# EAGLE design LockSequencer (EAGLE 7.7.0)
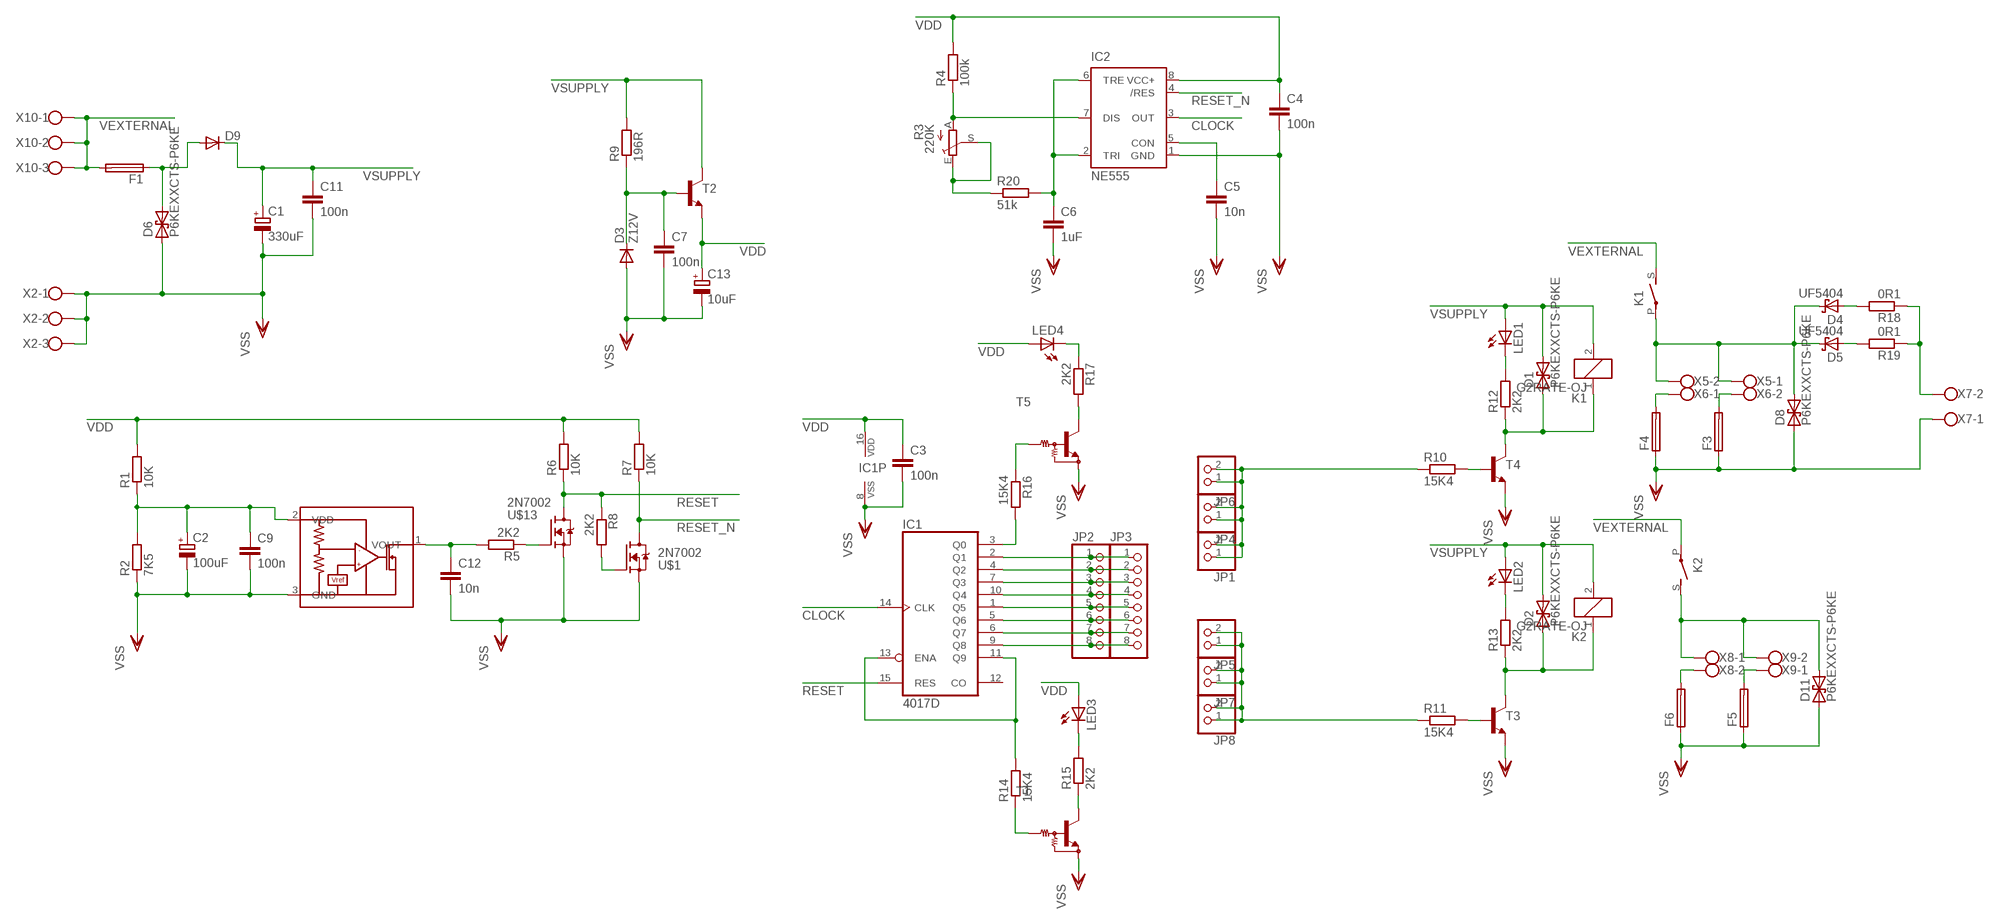
[diagram p0: schematic, sheet 1]

## Parts
C1  330uF  CPOL-EUE3.5-8  [E3,5-8]
C2  100uF  CPOL-EUE2-5  [E2-5]
C3  100n  C-EUC1206K  [C1206K]
C4  100n  C-EU050-024X044  [C050-024X044]
C5  10n  C-EUC1206K  [C1206K]
C6  1uF  C-EUC1206K  [C1206K]
C7  100n  C-EUC1206K  [C1206K]
C9  100n  C-EUC1206K  [C1206K]
C11  100n  C-EU050-024X044  [C050-024X044]
C12  10n  C-EUC1206K  [C1206K]
C13  10uF  CPOL-EUE2-5  [E2-5]
D1  P6KEXXCTS-P6KE  [DO15-10]
D2  P6KEXXCTS-P6KE  [DO15-10]
D3  Z12V  DIODE-SOD323-W  [SOD323-W]
D4  UF5404  SCHOTTKY-DIODECB429-15VR  [CB429-15R]
D5  UF5404  SCHOTTKY-DIODECB429-15V  [CB429-15V]
D6  P6KEXXCTS-P6KE  [DO15-10]
D8  P6KEXXCTS-P6KE  [DO15-10]
D9  DIODE-SOD123  [SOD123]
D11  P6KEXXCTS-P6KE  [DO15-10]
F1  TE5  [TE5]
F3  TE5  [TE5]
F4  TE5  [TE5]
F5  TE5  [TE5]
F6  TE5  [TE5]
IC1  4017D  [SO16]
IC2  NE555  [DIL-08]
JP1  PINHD-1X2  [1X02]
JP2  PINHD-1X8  [1X08]
JP3  PINHD-1X8  [1X08]
JP4  PINHD-1X2  [1X02]
JP5  PINHD-1X2  [1X02]
JP6  PINHD-1X2  [1X02]
JP7  PINHD-1X2  [1X02]
JP8  PINHD-1X2  [1X02]
K1  G2RATE-OJ  [G2RA-SHORTER]
K2  G2RATE-OJ  [G2RA-SHORTER]
LED1  LED5MM  [LED5MM]
LED2  LED5MM  [LED5MM]
LED3  LED5MM  [LED5MM]
LED4  LED5MM  [LED5MM]
R1  10K  R-EU_0207/7  [0207/7]
R2  7K5  R-EU_0207/7  [0207/7]
R3  220K  TRIM_EU-CA9V  [CA9V]
R4  100k  R-EU_0207/7  [0207/7]
R5  2K2  R-EU_R0402  [R0402]
R6  10K  R-EU_0207/7  [0207/7]
R7  10K  R-EU_R0805  [R0805]
R8  2K2  R-EU_0207/7  [0207/7]
R9  196R  R-EU_R0805  [R0805]
R10  15K4  R-EU_R0603  [R0603]
R11  15K4  R-EU_R0603  [R0603]
R12  2K2  R-EU_0207/7  [0207/7]
R13  2K2  R-EU_0207/7  [0207/7]
R14  15K4  R-EU_R0603  [R0603]
R15  2K2  R-EU_0207/7  [0207/7]
R16  15K4  R-EU_R0603  [R0603]
R17  2K2  R-EU_0207/7  [0207/7]
R18  0R1  R-EU_R2512  [R2512]
R19  0R1  R-EU_R2512  [R2512]
R20  51k  R-EU_0207/7  [0207/7]
T1  -NPN_DRIVER-  [SOT23]
T2  MMBTA42LT1-NPN-SOT23-BEC  [SOT23-BEC]
T3  MMBTA42LT1-NPN-SOT23-BEC  [SOT23-BEC]
T4  MMBTA42LT1-NPN-SOT23-BEC  [SOT23-BEC]
T5  -NPN_DRIVER-  [SOT23]
U$1  2N7002  [SOT23]
U$4  BU48XXG  [SOT95P280X125-5N]
U$13  2N7002  [SOT23]
X2  W237-103  [W237-103]
X5  W237-102  [W237-102]
X6  W237-102  [W237-102]
X7  W237-102  [W237-102]
X8  W237-102  [W237-102]
X9  W237-102  [W237-102]
X10  W237-103  [W237-103]

## Nets
CLOCK: IC1.14(CLK) IC2.3(OUT)
LATCH: JP1.1 JP1.2 JP4.1 JP4.2 JP6.1 JP6.2 R10.1
N$1: C5.1 IC2.5(CON)
N$2: C2.+ C9.1 R1.1 R2.2 U$4.2(VDD)
N$3: C12.1 R5.2 U$4.1(VOUT)
N$4: IC1.11(Q9) IC1.13(ENA) R14.2
N$5: IC1.5(Q6) JP2.6 JP3.6
N$6: IC1.6(Q7) JP2.7 JP3.7
N$7: IC1.7(Q3) JP2.3 JP3.3
N$8: LED2.K(C) R13.2
N$9: IC1.1(Q5) JP2.5 JP3.5
N$10: LED1.K(C) R12.2
N$11: F3.2 X6.2
N$12: IC1.9(Q8) JP2.8 JP3.8
N$13: LED4.K(C) R17.1
N$14: C6.1 IC2.2(TRI) IC2.6(TRE) R20.2
N$15: R10.2 T4.B
N$16: R14.1 T1.1(B)
N$17: R17.2 T5.3(C)
N$18: D2.A K2.1 R13.1 T3.C
N$20: IC1.3(Q0) R16.2
N$21: D4.C D5.C D8.C K1.P(2:P) X5.1 X5.2
N$22: F5.2 X9.1
N$23: R5.1 U$13.1(G)
N$24: IC2.7(DIS) R3.A R4.1
N$25: C7.1 D3.C R9.1 T2.B
N$26: R11.2 T3.B
N$27: D1.A K1.1 R12.1 T4.C
N$28: R8.2 U$1.1(G)
N$29: D4.A R18.2
N$30: F4.2 X6.1
N$31: R3.E R3.S R20.1
N$32: LED3.K(C) R15.2
N$33: R15.1 T1.3(C)
N$34: IC1.2(Q1) JP2.1 JP3.1
N$35: IC1.4(Q2) JP2.2 JP3.2
N$36: R16.1 T5.1(B)
N$37: D5.A R19.2
N$38: IC1.10(Q4) JP2.4 JP3.4
N$40: R18.1 R19.1 X7.2
N$43: D11.C K2.S(2:S) X8.1 X9.2
N$44: F6.2 X8.2
OPEN: JP5.1 JP5.2 JP7.1 JP7.2 JP8.1 JP8.2 R11.1
RESET: IC1.15(RES) R6.1 R8.1 U$13.3(D)
RESET_N: IC2.4(/RES) R7.1 U$1.3(D)
VDD [Ground]: C3.1 C4.1 C13.+ IC1.16(VDD) IC2.8(VCC+) LED3.A LED4.A R1.2 R4.2 R6.2 R7.2 T2.E
VEXTERNAL [Ground]: F1.2 K1.S(2:S) K2.P(2:P) X10.1 X10.2 X10.3
VEXTERNAL-FUSED: D6.C D9.A F1.1
VSS [Ground]: C1.- C2.- C3.2 C4.2 C5.2 C6.2 C7.2 C9.2 C11.2 C12.2 C13.- D3.A D6.A D8.A D11.A F3.1 F4.1 F5.1 F6.1 IC1.8(VSS) IC2.1(GND) R2.1 T1.2(E) T3.E T4.E T5.2(E) U$1.2(S) U$4.3(GND) U$13.2(S) X2.1 X2.2 X2.3 X7.1
VSUPPLY [Power]: C1.+ C11.1 D1.C D2.C D9.C K1.2 K2.2 LED1.A LED2.A R9.2 T2.C
Unconnected: IC1.12(CO)

## Library data of the parts
C1 C2 C13 = rcl:CPOL-EU: POLARIZED CAPACITOR, European symbol
C3-C7 C9 C11 C12 = rcl:C-EU: CAPACITOR, European symbol
D1 D2 D6 D8 D11 = diode:P6KEXXC: DIODE transient-voltage suppressor
D3 D9 = diode:DIODE-: DIODE
D4 D5 = diode:SCHOTTKY-DIODE: Schottky Diode
F1 F3-F6 = fuse:TE5: FUSE Wickmann; OC_FARNELL: unknown; OC_NEWARK: unknown
IC1 = 40xx:4017: COUNTER/DIVIDER
IC2 = st-microelectronics:NE555: General purpose bipolar Timer; MF: Arrow Electronics; MPN: NE555N; OC_FARNELL: 1467742; OC_NEWARK: 89K1486
JP1 JP4-JP8 = pinhead:PINHD-1X2: PIN HEADER
JP2 JP3 = pinhead:PINHD-1X8: PIN HEADER
K1 K2 = relay:G2RA: RELAY 1 x norm. open, Omron
LED1-LED4 = led:LED: LED OSRAM: - CHIPLED LG R971, LG N971, LY N971, LG Q971, LY Q971, LO R971, LY R971 LH N974, LH R974 LS Q976, LO Q976, LY Q976 LO Q996 - Hyper CHIPLED LW Q18S LB Q993, LB Q99A, LB R99A - SideLED LS A670, LO A670, LY A670, LG A670, LP A670 LB A673, LV A673, LT A673, LW A673 LH A674 LY A675 LS A676, LA A676, LO A676, LY A676, LW A676 LS A679, LY A679, LG A679 - Hyper Micro SIDELED® LS Y876, LA Y876, LO Y876, LY Y876 LT Y87S - SmartLED LW L88C, LW L88S LB L89C, LB L89S, LG L890 LS L89K, LO L89K, LY L89K LS L896, LA L896, LO L896, LY L896 - TOPLED LS T670, LO T670, LY T670, LG T670, LP T670 LSG T670, LSP T670, LSY T670, LOP T670, LYG T670 LG T671, LOG T671, LSG T671 LB T673, LV T673, LT T673, LW T673 LH T674 LS T676, LA T676, LO T676, LY T676, LB T676, LH T676, LSB T676, LW T676 LB T67C, LV T67C, LT T67C, LS T67K, LO T67K, LY T67K, LW E67C LS E67B, LA E67B, LO E67B, LY E67B, LB E67C, LV E67C, LT E67C LW T67C LS T679, LY T679, LG T679 LS T770, LO T770, LY T770, LG T770, LP T770 LB T773, LV T773, LT T773, LW T773 LH T774 LS E675, LA E675, LY E675, LS T675 LS T776, LA T776, LO T776, LY T776, LB T776 LHGB T686 LT T68C, LB T68C - Hyper Mini TOPLED® LB M676 - Mini TOPLED Santana® LG M470 LS M47K, LO M47K, LY M47K Source: http://www.osram.convergy.de LUXEON: - LUMILED® LXK2-PW12-R00, LXK2-PW12-S00, LXK2-PW14-U00, LXK2-PW14-V00 LXK2-PM12-R00, LXK2-PM12-S00, LXK2-PM14-U00 LXK2-PE12-Q00, LXK2-PE12-R00, LXK2-PE12-S00, LXK2-PE14-T00, LXK2-PE14-U00 LXK2-PB12-K00, LXK2-PB12-L00, LXK2-PB12-M00, LXK2-PB14-N00, LXK2-PB14-P00, LXK2-PB14-Q00 LXK2-PR12-L00, LXK2-PR12-M00, LXK2-PR14-Q00, LXK2-PR14-R00 LXK2-PD12-Q00, LXK2-PD12-R00, LXK2-PD12-S00 LXK2-PH12-R00, LXK2-PH12-S00 LXK2-PL12-P00, LXK2-PL12-Q00, LXK2-PL12-R00 Source: www.luxeon.com KINGBRIGHT: KA-3528ASYC Source: www.kingbright.com
R1 R2 R4-R20 = rcl:R-EU_: RESISTOR, European symbol
R3 = pot:TRIM_EU-: POTENTIOMETER
T1 T5 = transistor:*-NPN_DRIVER-: NPN Bias Resistor Transistor
T2-T4 = transistor:*-NPN-: NPN Transistror BF959 corrected 2008.03.06
U$1 U$13 = transistor-fet:2N7002
U$4 = ROHM_By_element14_Batch_1:BU48XXG
X2 X10 = con-wago-500:W237-103: WAGO SCREW CLAMP; MPN: 237-103; OC_FARNELL: unknown; OC_NEWARK: 18M7116
X5-X9 = con-wago-500:W237-102: WAGO SCREW CLAMP; MPN: 237-102; OC_FARNELL: unknown; OC_NEWARK: 70K9898

## Net classes
1 Power: width 0.318 mm, clearance 0.381 mm
3 Ground: width 0.318 mm, clearance 0.381 mm

## Board
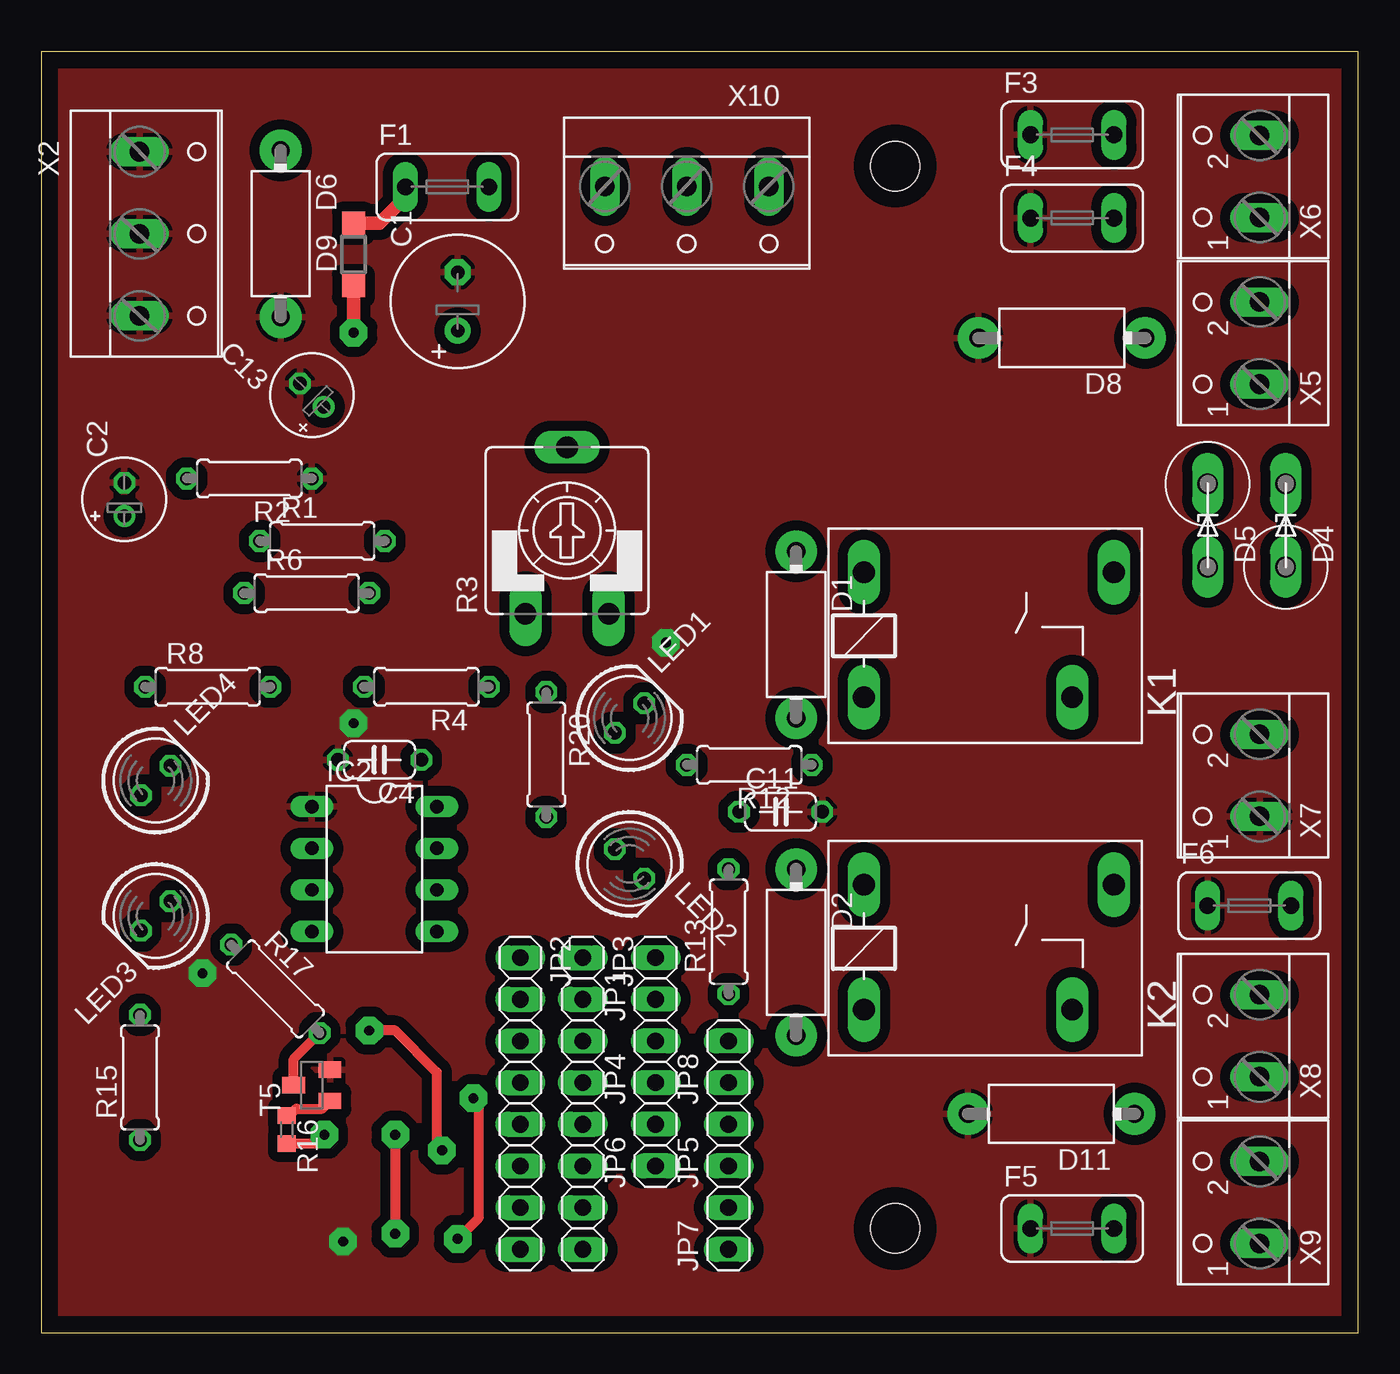
[diagram p1: board, top side]
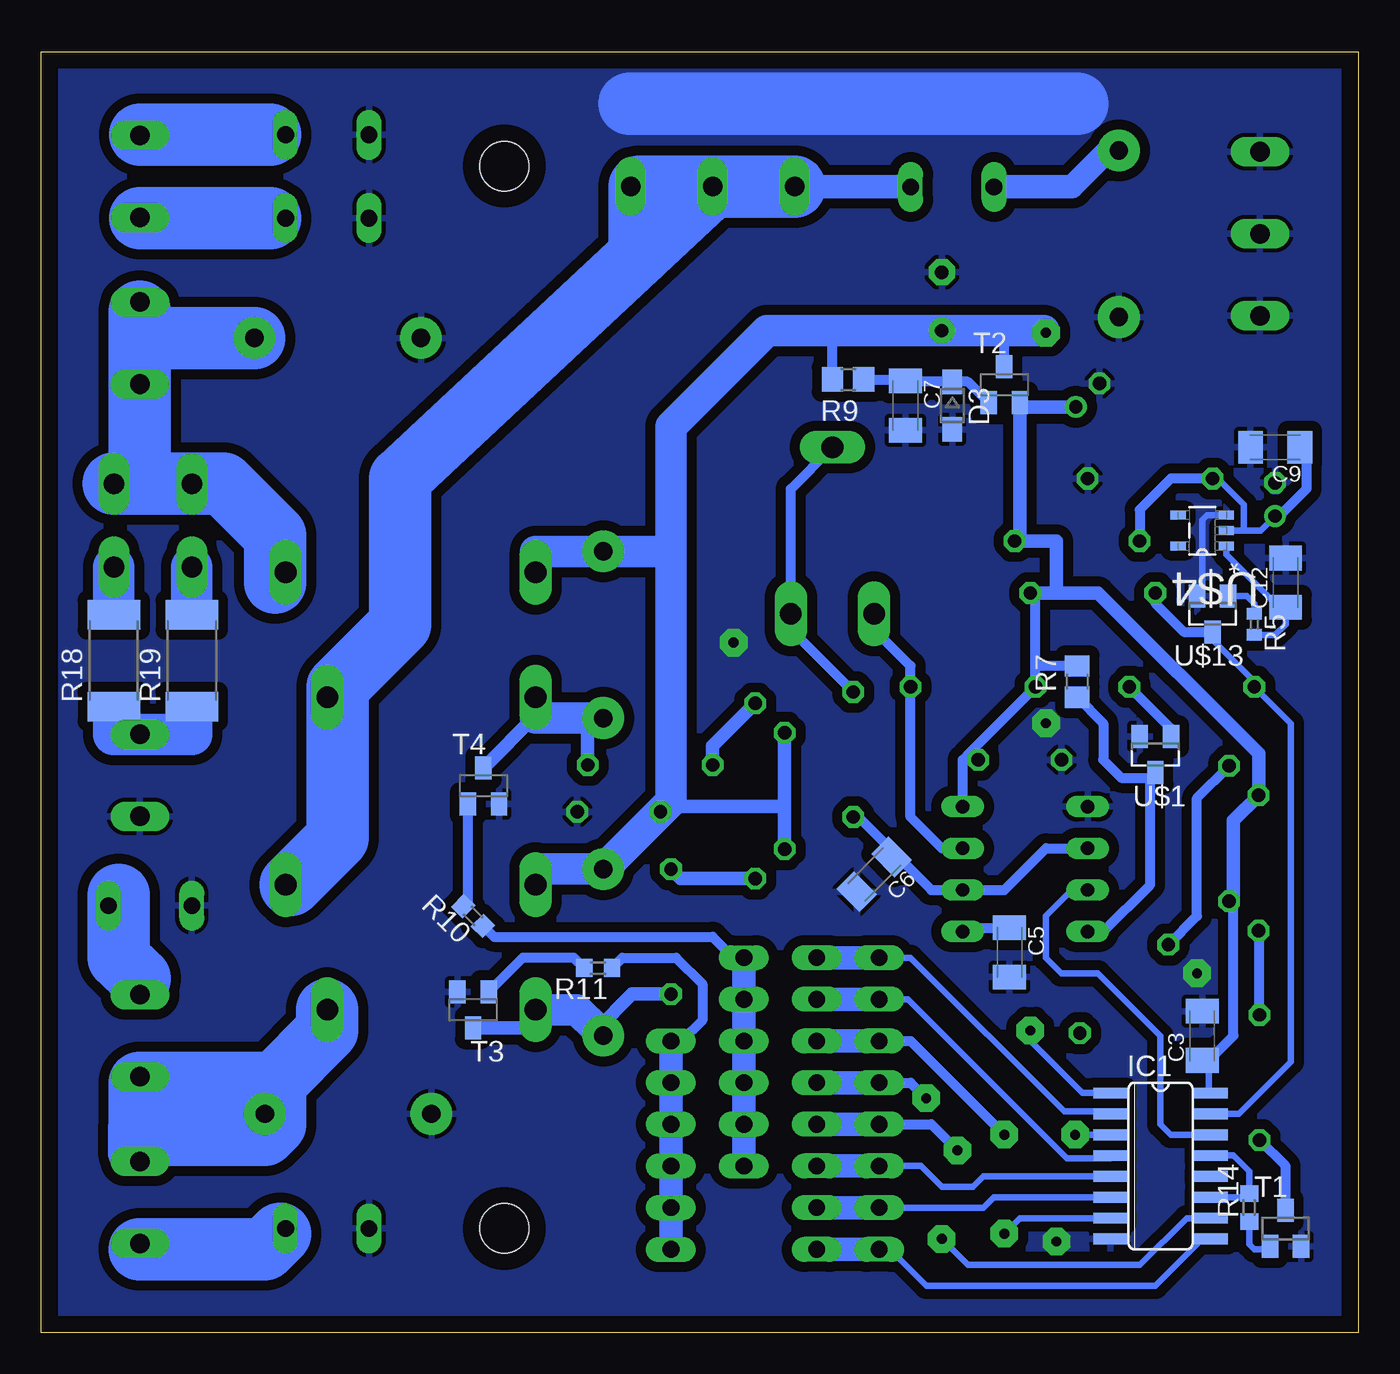
[diagram p2: board, bottom side, seen from below]

Size 80.31 x 78.09 mm. Coordinates in mm from the lower left corner, seen from the top.
Outline: 0,0 80.31,0 80.31,78.09 0,78.09 0,0
Copper layers (1*16): Top 0.035mm / dielectric 1.5mm / Bottom 0.035mm
Design rules "default *": minimum track width 16mil, minimum drill 24mil, track to track 16mil, track to pad 16mil, pad to pad 16mil, via to via 16mil, smd to smd 12.5mil, copper to edge 40mil, drill to drill 8mil, minimum pad ring 10mil, minimum via ring 8mil, stop-mask expansion 4mil, vias tented up to drill 0mil, thermal gap 10mil
Holes 3 mm at 52.07,71.12 52.07,6.35

### Footprints (pad centres in the part's own frame; a part is rotated, then mirrored left to right if it is on the bottom)
E3,5-8 = drill 0.813 pad 1.6: + -1.778,0 | drill 0.813 pad 1.6 octagon: - 1.778,0
E2-5 = drill 0.813 pad 1.27: + -1.016,0 | drill 0.813 pad 1.27 octagon: - 1.016,0
C1206K = smd 1.5 x 2: 1 -1.5,0; 2 1.5,0
C050-024X044 = drill 0.813 octagon: 1 -2.54,0; 2 2.54,0
DO15-10 = drill 1.118 pad 2.54: A 5.08,0; C -5.08,0
SOD323-W = smd 1.5 x 1.2: A 1.45,0; C -1.45,0
CB429-15R = drill 1.25 pad 1.422 long: A 2.54,0; C -2.54,0
CB429-15V = drill 1.25 pad 1.422 long: A 2.54,0; C -2.54,0
SOD123 = smd 1.4 x 1.4: A 1.9,0; C -1.9,0
TE5 = drill 1.016 long: 1 -2.54,0; 2 2.54,0
SO16 = smd 0.66 x 2.032: 1 -4.445,-3.073; 2 -3.175,-3.073; 3 -1.905,-3.073; 4 -0.635,-3.073; 5 0.635,-3.073; 6 1.905,-3.073; 7 3.175,-3.073; 8 4.445,-3.073; 9 4.445,3.073; 10 3.175,3.073; 11 1.905,3.073; 12 0.635,3.073; 13 -0.635,3.073; 14 -1.905,3.073; 15 -3.175,3.073; 16 -4.445,3.073
DIL-08 = drill 0.813 long: 1 -3.81,-3.81; 2 -1.27,-3.81; 3 1.27,-3.81; 4 3.81,-3.81; 5 3.81,3.81; 6 1.27,3.81; 7 -1.27,3.81; 8 -3.81,3.81
1X02 = drill 1.016 long: 1 -1.27,0; 2 1.27,0
1X08 = drill 1.016 long: 1 -8.89,0; 2 -6.35,0; 3 -3.81,0; 4 -1.27,0; 5 1.27,0; 6 3.81,0; 7 6.35,0; 8 8.89,0
G2RA-SHORTER = drill 1.321 long: 1 -3.81,-3.81; 2 -3.81,3.81; P 11.43,3.81; S 8.89,-3.81
LED5MM = drill 0.813 octagon: A -1.27,0; K 1.27,0
0207/7 = drill 0.813 octagon: 1 -3.81,0; 2 3.81,0
CA9V = drill 1.321 long: A -2.54,-5.08; E 2.54,-5.08; S 0,5.08
R0402 = smd 0.7 x 0.9: 1 -0.65,0; 2 0.65,0
R0805 = smd 1.3 x 1.5: 1 -0.95,0; 2 0.95,0
R0603 = smd 1 x 1.1: 1 -0.85,0; 2 0.85,0
R2512 = smd 1.8 x 3.2: 1 -2.8,0; 2 2.8,0
SOT23 = smd 1 x 1.4: 1 -0.95,-1.1; 2 0.95,-1.1; 3 0,1.1
SOT23-BEC = smd 1 x 1.4: B -0.95,-1.1; C 0,1.1; E 0.95,-1.1
SOT95P280X125-5N = smd 0.914 x 0.533: 1 -1.473,0.94; 2 -1.473,0; 3 -1.473,-0.94; 4 1.473,-0.94; 5 1.473,0.94
W237-103 = drill 1.194 long: 1 -5,-1.29; 2 0,-1.29; 3 5,-1.29
W237-102 = drill 1.194 long: 1 -2.5,-1.27; 2 2.5,-1.27

### Placement (x,y rotation side)
C1  25.4,62.87 90 top
C2  5.08,50.8 90 top
C3  9.53,18.1 90 bottom
C4  20.64,34.92 180 top
C5  21.27,23.18 270 bottom
C6  29.53,27.94 225 bottom
C7  27.62,56.52 270 bottom
C9  5.08,53.98 180 bottom
C11  45.09,31.75 0 top
C12  4.45,45.72 90 bottom
C13  16.51,57.15 135 top
D1  46.04,42.55 270 top
D2  46.04,23.18 270 top
D3  24.77,56.52 270 bottom
D4  75.88,49.21 270 top
D5  71.12,49.21 270 top
D6  14.61,66.99 270 top
D8  62.23,60.64 180 top
D9  19.05,65.72 90 top
D11  61.59,13.34 180 top
F1  24.77,69.85 0 top
F3  62.87,73.03 0 top
F4  62.87,67.94 0 top
F5  62.87,6.35 0 top
F6  73.66,26.04 0 top
IC1  12.06,10.16 270 bottom
IC2  20.32,28.26 270 top
JP1  37.47,21.59 90 top
JP2  29.21,13.97 270 top
JP3  33.02,13.97 270 top
JP4  37.47,16.51 90 top
JP5  41.91,11.43 90 top
JP6  37.47,11.43 90 top
JP7  41.91,6.35 90 top
JP8  41.91,16.51 90 top
K1  53.98,42.55 0 top
K2  53.98,23.5 0 top
LED1  35.88,37.47 45 top
LED2  35.88,28.57 315 top
LED3  6.99,25.4 225 top
LED4  6.99,33.66 45 top
R1  17.14,48.26 0 top
R2  12.7,52.07 180 top
R3  32.07,48.9 0 top
R4  23.5,39.37 180 top
R5  6.35,43.18 270 bottom
R6  16.19,45.09 0 top
R7  17.14,39.69 90 bottom
R8  10.16,39.37 0 top
R9  31.11,58.1 180 bottom
R10  53.98,25.4 135 bottom
R11  46.35,22.23 180 bottom
R12  43.18,34.61 180 top
R13  41.91,24.45 90 top
R14  6.67,7.62 90 bottom
R15  6.03,15.56 90 top
R16  14.99,12.38 270 top
R17  14.29,20.95 315 top
R18  75.88,40.96 90 bottom
R19  71.12,40.96 90 bottom
R20  30.8,35.24 270 top
T1  4.45,6.35 0 bottom
T2  21.59,57.78 0 bottom
T3  53.98,19.68 180 bottom
T4  53.34,33.34 0 bottom
T5  16.51,15.08 90 top
U$1  12.38,35.24 180 bottom
U$4  9.53,48.9 180 bottom
U$13  8.89,43.81 180 bottom
X2  7.3,66.99 270 top
X5  73.03,60.33 90 top
X6  73.03,70.48 90 top
X7  73.03,33.97 90 top
X8  73.03,18.1 90 top
X9  73.03,7.94 90 top
X10  39.37,68.58 180 top

### Tracks (layer width: path | path; a pad name or v marks a point on that pad's centre or on a via)
CLOCK
  Bottom 0.406: IC1.14 11.43,12.06 12.06,12.7 12.06,18.1 15.88,21.91 18.1,21.91 19.05,22.86 19.05,25.4 17.46,26.99 IC2.3
LATCH
  Bottom 0.61: R10.1 52.7,24.13 39.37,24.13 37.47,22.23
  Bottom 1.422: JP6.1 JP6.2 JP4.1 JP4.2 JP1.1 37.47,22.23 JP1.2
N$1
  Bottom 0.61: IC2.5 23.9,24.68 C5.1
N$2
  Bottom 0.406: U$4.2 6.99,48.9 | 6.99,48.9 5.97,48.9 C2.+ 5.33,49.78 | 6.99,48.9 6.99,50.48 8.57,52.07 R2.2
  Bottom 0.61: C9.1 3.17,53.98 3.17,51.44 4.83,49.78 C2.+ | R2.2 11.43,52.07 13.34,50.16 R1.1
N$3
  Bottom 0.406: U$4.1 8.05,47.42 4.85,44.22 C12.1 4.45,43.18 5.09,42.53 R5.2
N$4
  Bottom 0.406: 8.91,8.19 IC1.11 6.67,8.26 R14.2 6.67,9.84 7.62,10.79 IC1.13
N$5
  Bottom 0.406: IC1.5 22.86,9.53 23.5,8.89 25.4,8.89 26.67,10.16 JP2.6
  Bottom 1.422: JP2.6 JP3.6
N$6
  Bottom 0.406: IC1.6 22.23,8.26 22.86,7.62 JP2.7
  Bottom 1.422: JP2.7 JP3.7
N$7  (via drill 0.6 pad 1.68)
  Top 0.61: v21.59,12.06 v21.59,6.03
  Bottom 0.406: IC1.7 20.64,6.99 v21.59,6.03
  Bottom 0.61: JP2.3 27.3,17.78 v21.59,12.06
  Bottom 1.422: JP2.3 JP3.3
N$8
  Bottom 0.813: R13.2 41.33,27.68 LED2.K
N$9  (via drill 0.6 pad 1.68)
  Top 0.61: v20,18.41 21.59,18.41 24.13,15.88 24.13,11.43 v24.45,11.11
  Bottom 0.406: IC1.1 16.83,14.61 20,17.78 v20,18.41
  Bottom 0.61: JP2.5 26.04,12.7 v24.45,11.11
  Bottom 1.422: JP2.5 JP3.5
N$10
  Bottom 0.813: R12.2 39.37,35.77 LED1.K
N$11
  Bottom 0.61: X6.2 74.25,73.03 | F3.2 66.36,73.03
  Bottom 3.81: 74.25,73.03 66.36,73.03
N$12
  Bottom 0.406: JP2.8 28.57,5.08 26.35,2.86 12.38,2.86 9.53,5.71 IC1.9
  Bottom 1.422: JP2.8 JP3.8
N$13
  Bottom 0.61: LED4.K 9.84,32.59 9.84,25.4 R17.1
N$14
  Bottom 0.61: IC2.2 19.05,29.53 21.59,26.99 IC2.6 26.04,26.99 28.26,29.21 | C6.1 28.26,29.21 | 28.26,29.21 30.48,31.43 R20.2
N$15
  Bottom 0.61: R10.2 54.29,26 54.29,27.62 | 54.29,27.62 | 54.29,27.62 T4.B
N$16
  Bottom 0.406: T1.1 5.39,5.08 6.35,5.08 6.67,5.4 R14.1
N$17
  Top 0.61: 16.68,17.96 R17.2 15.41,16.69 T5.3
N$18
  Bottom 0.813: 46.43,18.49 44.28,20.64 R13.1 | T3.C 50.16,18.59 K2.1
  Bottom 1.93: D2.A 46.43,18.49 47.62,19.68 K2.1
N$20  (via drill 0.6 pad 1.68)
  Top 0.61: 17.25,12.04 v17.27,12.06 17.27,11.53 R16.2
  Bottom 0.406: IC1.3 v17.27,12.06
N$21
  Bottom 0.61: 74.3,62.23 X5.2 | 66.04,45.72 K1.P
  Bottom 3.81: 74.3,60.64 X5.1 74.3,51.75 | 74.3,60.64 74.3,62.23 | D8.C 74.3,60.64 | D4.C 74.3,51.75 | 74.3,51.75 D5.C 69.22,51.75 66.04,48.58 66.04,45.72
N$22
  Bottom 0.61: X9.1 74.3,5.08 | F5.2 66.04,5.71
  Bottom 3.81: 74.3,5.08 66.67,5.08 66.04,5.71 65.72,6.03
N$23
  Bottom 0.406: R5.1 6.35,44.45 6.82,44.91 U$13.1
N$24
  Bottom 0.61: IC2.7 25.4,29.53 27.3,31.43 R4.1 27.3,40.64 29.53,42.86 R3.A
N$25
  Bottom 0.61: R9.1 27.71,58.1 C7.1 27.62,57.97 D3.C 23.82,57.97 T2.B
N$26
  Bottom 0.61: T3.B 50.95,22.86 47.84,22.86 R11.2
N$27
  Bottom 0.813: R12.1 46.99,37.47 | T4.C 50.16,37.61 K1.1
  Bottom 1.93: D1.A 46.99,37.47 50.16,37.47 K1.1
N$28
  Bottom 0.61: R8.2 11.43,36.83 U$1.1
N$29
  Bottom 0.61: 75.88,44.77 R18.2
  Bottom 2.54: D4.A 75.88,44.77
N$30
  Bottom 0.61: X6.1 74.25,67.94 | F4.2 66.36,67.94
  Bottom 3.81: 74.25,67.94 66.36,67.94
N$31
  Bottom 0.61: R20.1 34.61,42.86 R3.E 34.61,51.44 R3.S
N$32
  Bottom 0.61: R15.2 6.03,24.5 LED3.K
N$33
  Bottom 0.61: T1.3 4.45,10.16 R15.1
N$34
  Bottom 0.406: JP2.1 27.3,22.86 17.94,13.49 15.14,13.49 IC1.2
  Bottom 1.422: JP2.1 JP3.1
N$35
  Bottom 0.406: IC1.4 15.14,10.64 17.78,10.64 27.46,20.32 JP2.2
  Bottom 1.422: JP2.2 JP3.2
N$36
  Top 0.61: R16.1 15.14,13.23 15.56,13.65 17.14,13.65 17.61,14.12 T5.1 17.31,14.13
N$37
  Bottom 0.61: 71.12,44.77 R19.2
  Bottom 2.54: D5.A 71.12,44.77
N$38  (via drill 0.6 pad 1.68)
  Top 0.61: v25.4,5.71 26.67,6.99 26.67,13.97 v26.35,14.29
  Bottom 0.406: v25.4,5.71 23.81,4.13 13.34,4.13 10.48,6.99 IC1.10
  Bottom 0.61: JP2.4 27.3,15.24 v26.35,14.29
  Bottom 1.422: JP2.4 JP3.4
N$40
  Bottom 0.61: R18.1 75.88,37.47 | R19.1 71.12,37.78
  Bottom 2.54: 75.88,37.78 75.88,37.47 75.88,36.47 X7.2 71.12,36.47 71.12,37.78
N$43
  Bottom 0.61: 66.04,15.24 66.04,15.88 | X8.1 74.3,15.24 | D11.C 66.67,12.7 66.36,12.38
  Bottom 1.27: 75.56,12.7 75.56,10.76 X9.2 74.3,12.06
  Bottom 3.81: 74.3,12.7 74.3,12.06 66.67,12.06 66.36,12.38 66.04,12.7 | 66.67,15.24 74.3,15.24 74.3,12.7 | 66.04,12.7 66.04,15.24 62.87,18.41 K2.S | 66.04,12.7 74.3,12.7
N$44
  Bottom 0.61: 74.3,21.59 X8.2 | F6.2 75.56,26.67
  Bottom 3.81: 75.56,26.67 75.56,22.86 74.3,21.59
OPEN
  Bottom 0.61: 42.12,14.82 41.91,14.61 | R11.1 44.87,22.86 41.59,22.86 40.01,21.27 40.01,19.05 41.27,17.78 JP8.2
  Bottom 1.422: JP7.1 JP7.2 JP5.1 JP5.2 41.91,14.61 JP8.1 JP8.2
RESET
  Bottom 0.406: 9.06,42.55 U$13.3 | U$13.3 8.89,42.55 | IC1.15 7.3,13.34 4.13,16.51 4.13,37.15 R8.1 6.35,39.69 8.89,42.23 U$13.3
  Bottom 0.61: R6.1 12.38,44.45 10.65,42.72 U$13.3
RESET_N
  Bottom 0.61: 12.7,33.83 14.46,33.83 15.56,34.92 15.56,37.15 R7.1 | 12.7,33.83 12.7,27.3 15.56,24.45 IC2.4 | 12.7,33.83 12.38,33.83 U$1.3
VDD
  Bottom 0.406: IC1.16 9.12,14.73 9.12,16.28
  Bottom 0.61: 9.12,16.28 C3.1 9.12,16.6 7.62,18.1 7.62,26.3 LED3.A | IC2.8 24.13,34.92 23.65,35.4 | 23.65,35.4 R4.2 19.68,40.64 | 19.68,40.64 19.68,44.77 R6.2 | R7.2 19.68,40.64 | C4.1 23.65,35.4
  Bottom 0.813: 18.41,45.09 18.41,48.26 R1.2 20.64,48.26 T2.E | 18.41,45.09 R6.2 | 18.41,45.09 15.88,45.09 6.09,35.3 LED4.A 7.62,31.22 7.62,26.56 LED3.A | 20.64,56.83 T2.E | C13.+ 20.64,56.43 T2.E
VEXTERNAL
  Bottom 0.61: 43.81,69.87 X10.1 | 39.37,69.85 X10.2 | K1.S 62.23,38.73 | K2.P 65.25,27.46 64.93,27.46
  Bottom 1.422: 34.91,69.85 34.92,69.87 | F1.2 27.32,69.87 X10.3
  Bottom 3.81: X10.3 34.92,69.87 X10.2 43.81,69.87 43.82,69.87 43.82,65.7 | 39.37,69.85 58.42,52.07 58.42,43.18 62.23,39.37 62.23,38.73 62.23,30.16 64.93,27.46 65.09,27.3
VEXTERNAL-FUSED
  Top 0.813: D9.A 20.63,67.62 22.23,69.22 F1.1
  Bottom 1.422: D6.C 15.24,72.07 17.46,69.85 F1.1
VSS  (via drill 0.6 pad 1.68)
  Bottom 0.406: U$4.3 9.22,49.84 9.53,49.53 9.53,45.23 U$13.2
  Bottom 3.81: 44.45,74.93 17.12,74.93
  other vias: 18.41,5.56 19.05,37.15 9.84,21.91 38.1,42.07
  pour Bottom (isolate 0.61): 80.01,0.64 80.01,77.47 0.64,77.47 0.64,0.64
  pour Top (isolate 0.61): 0.64,0.64 80.01,0.64 80.01,77.47 0.64,77.47
VSUPPLY  (via drill 0.6 pad 1.68)
  Top 0.813: D9.C v19.05,60.96
  Bottom 0.61: R9.2 32.06,60.77 31.75,61.09 | v19.05,60.96 19.18,61.09 | T2.C 21.59,61.09
  Bottom 0.813: 34.98,32.07 42.55,32.07 C11.1 | 34.98,32.07 LED1.A | 34.98,32.07 LED2.A
  Bottom 1.93: 41.91,47.62 41.91,55.24 36.07,61.09 31.75,61.09 C1.+ 21.59,61.09 19.18,61.09 | 41.91,47.62 41.91,32.38 C11.1 D2.C 50.16,28.26 K2.2 | 41.91,47.62 D1.C 50.16,47.62 K1.2